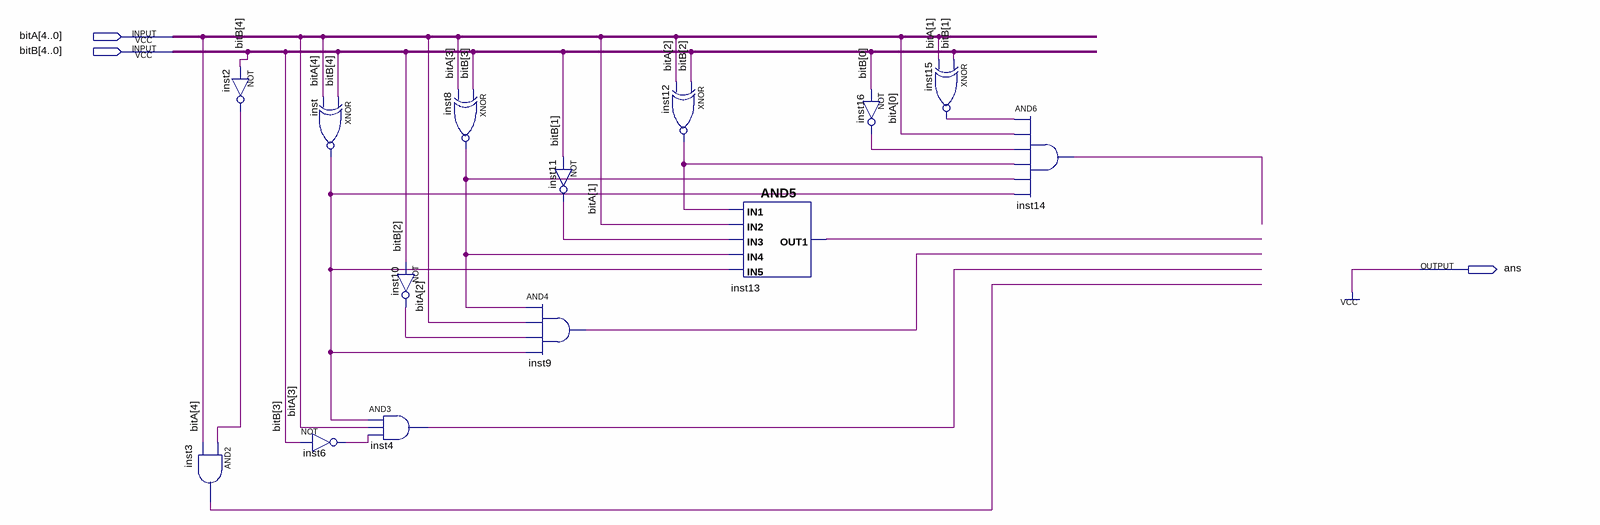
[diagram p0: schematic sheet]
// Quartus schematic cmp.bdf as structural Verilog: 14 symbols, 3 pins
module cmp (
  input  [4:0] bitA,
  input  [4:0] bitB,
  output ans
);

  wire inst2_out, inst3_out, inst4_out, inst6_out, inst8_out, inst9_out, inst10_out, inst11_out, inst12_out,
       inst13_out1, inst14_out, inst15_out, inst16_out, inst_out;

  and inst3 (inst3_out, inst2_out, bitA[4]);
  not inst2 (inst2_out, bitB[4]);
  xnor inst (inst_out, bitB[4], bitA[4]);
  not inst6 (inst6_out, bitB[3]);
  and inst4 (inst4_out, inst_out, bitA[3], inst6_out);
  xnor inst8 (inst8_out, bitB[3], bitA[3]);
  not inst10 (inst10_out, bitB[2]);
  not inst11 (inst11_out, bitB[1]);
  and inst9 (inst9_out, inst8_out, bitA[2], inst10_out, inst_out);
  xnor inst12 (inst12_out, bitB[2], bitA[2]);
  AND5 inst13 (.IN3(inst11_out), .IN2(bitA[1]), .IN1(inst12_out), .IN5(inst_out), .IN4(inst8_out), .OUT1(inst13_out1));
  not inst16 (inst16_out, bitB[0]);
  xnor inst15 (inst15_out, bitB[1], bitA[1]);
  and inst14 (inst14_out, inst15_out, bitA[0], inst16_out, inst12_out, inst8_out, inst_out);

  assign ans = 1'b1;
endmodule
